# Altium schematic sheet starter.SchDoc
size A4
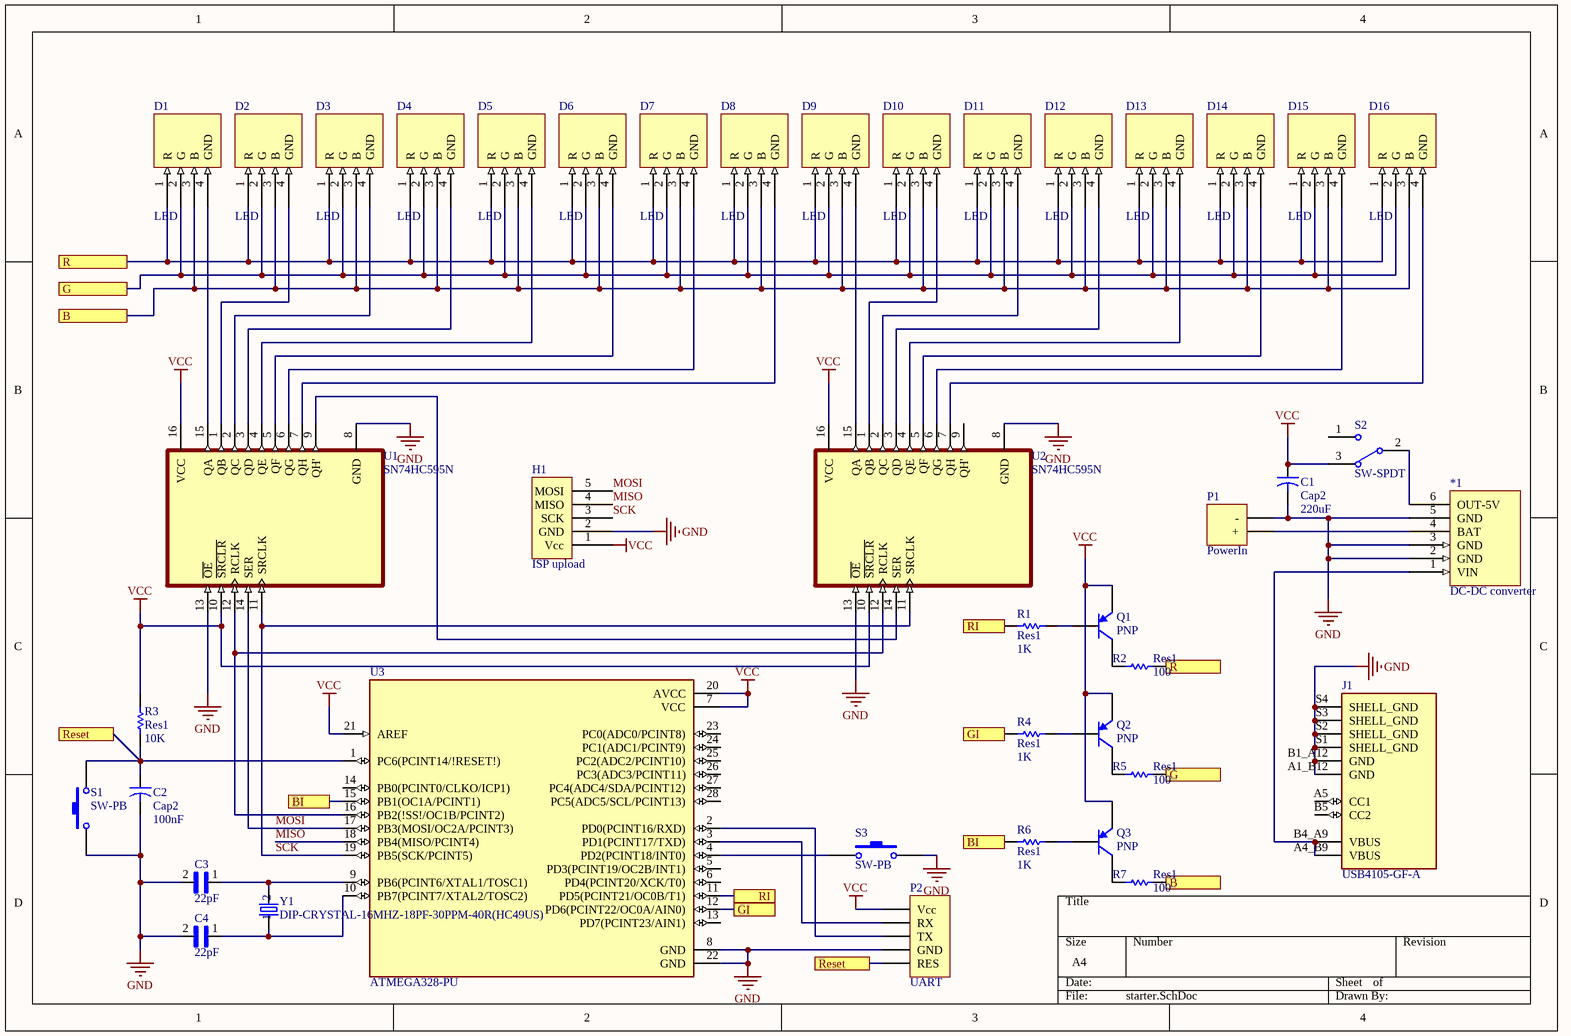
[diagram p0: starter.SchDoc]

## Parts
*1  DC-DC converter  [DC-DC converter]
C1  Cap2  value 220uF  [cap 220]
C2  Cap2  value 100nF  [CAPR5-4X5]
C3  22pF  [CAPR5-4X5]
C4  22pF  [CAPR5-4X5]
D1  LED  [RGB LED]
D2  LED  [RGB LED]
D3  LED  [RGB LED]
D4  LED  [RGB LED]
D5  LED  [RGB LED]
D6  LED  [RGB LED]
D7  LED  [RGB LED]
D8  LED  [RGB LED]
D9  LED  [RGB LED]
D10  LED  [RGB LED]
D11  LED  [RGB LED]
D12  LED  [RGB LED]
D13  LED  [RGB LED]
D14  LED  [RGB LED]
D15  LED  [RGB LED]
D16  LED  [RGB LED]
H1  ISP upload  [HDR1X5]
J1  USB4105-GF-A  [GCT_USB4105-GF-A]
P1  PowerIn  [PowerIn]
P2  UART  [UART]
Q1  PNP  [TO-226-AE]
Q2  PNP  [TO-226-AE]
Q3  PNP  [TO-226-AE]
R1  Res1  value 1K  [AXIAL-0.3]
R2  Res1  value 100  [AXIAL-0.3]
R3  Res1  value 10K  [AXIAL-0.3]
R4  Res1  value 1K  [AXIAL-0.3]
R5  Res1  value 100  [AXIAL-0.3]
R6  Res1  value 1K  [AXIAL-0.3]
R7  Res1  value 100  [AXIAL-0.3]
S1  SW-PB  [SPST-2]
S2  SW-SPDT  [SW-TRI]
S3  SW-PB  [SPST-2]
U1  SN74HC595N  [DIP794W45P254L1969H508Q16]
U2  SN74HC595N  [DIP794W45P254L1969H508Q16]
U3  ATMEGA328-PU  [DIP787W46P254L3467H508Q28]
Y1  DIP-CRYSTAL-16MHZ-18PF-30PPM-40R(HC49US)  [HC49US]

## Ports
B, BI, G, GI, R, Reset, RI

## Nets
GND: *1.2(GND) *1.3(GND) *1.5(GND) C1.2 C2.2 C3.2 C4.2 H1.2(GND) J1.A1_B12(GND) J1.B1_A12(GND) J1.S1(SHELL_GND) J1.S2(SHELL_GND) J1.S3(SHELL_GND) J1.S4(SHELL_GND) P1.2(-) P2.4(GND) S1.1 S3.2 U1.8(GND) U1.13(~{OE}) U2.8(GND) U2.13(~{OE}) U3.8(GND) U3.22(GND)
VCC: C1.1 H1.1(Vcc) P2.1(Vcc) Q1.3(E) Q2.3(E) Q3.3(E) R3.2 S2.3 U1.10(~{SRCLR}) U1.16(VCC) U2.10(~{SRCLR}) U2.16(VCC) U3.7(VCC) U3.20(AVCC) U3.21(AREF)
B: D1.3(B) D2.3(B) D3.3(B) D4.3(B) D5.3(B) D6.3(B) D7.3(B) D8.3(B) D9.3(B) D10.3(B) D11.3(B) D12.3(B) D13.3(B) D14.3(B) D15.3(B) D16.3(B) R7.2 ; port B
BI: R6.2 U3.15(PB1(OC1A/PCINT1)) ; port BI
G: D1.2(G) D2.2(G) D3.2(G) D4.2(G) D5.2(G) D6.2(G) D7.2(G) D8.2(G) D9.2(G) D10.2(G) D11.2(G) D12.2(G) D13.2(G) D14.2(G) D15.2(G) D16.2(G) R5.2 ; port G
GI: R4.2 U3.12(PD6(PCINT22/OC0A/AIN0)) ; port GI
MISO: H1.4(MISO) U3.18(PB4(MISO/PCINT4))
MOSI: H1.5(MOSI) U1.14(SER) U3.17(PB3(MOSI/OC2A/PCINT3))
R: D1.1(R) D2.1(R) D3.1(R) D4.1(R) D5.1(R) D6.1(R) D7.1(R) D8.1(R) D9.1(R) D10.1(R) D11.1(R) D12.1(R) D13.1(R) D14.1(R) D15.1(R) D16.1(R) R2.2 ; port R
Reset: C2.1 P2.5(RES) R3.1 S1.2 U3.1(PC6(PCINT14/!RESET!)) ; port Reset
RI: R1.2 U3.11(PD5(PCINT21/OC0B/T1)) ; port RI
SCK: H1.3(SCK) U1.11(SRCLK) U2.11(SRCLK) U3.19(PB5(SCK/PCINT5))
Net*1_1: *1.1(VIN) J1.A4_B9(VBUS) J1.B4_A9(VBUS)
Net*1_4: *1.4(BAT) P1.1(+)
Net*1_6: *1.6(OUT-5V) S2.2
NetC3_1: C3.1 U3.9(PB6(PCINT6/XTAL1/TOSC1)) Y1.2
NetC4_1: C4.1 U3.10(PB7(PCINT7/XTAL2/TOSC2)) Y1.1
NetD1_4: D1.4(GND) U1.15(QA)
NetD2_4: D2.4(GND) U1.1(QB)
NetD3_4: D3.4(GND) U1.2(QC)
NetD4_4: D4.4(GND) U1.3(QD)
NetD5_4: D5.4(GND) U1.4(QE)
NetD6_4: D6.4(GND) U1.5(QF)
NetD7_4: D7.4(GND) U1.6(QG)
NetD8_4: D8.4(GND) U1.7(QH)
NetD9_4: D9.4(GND) U2.15(QA)
NetD10_4: D10.4(GND) U2.1(QB)
NetD11_4: D11.4(GND) U2.2(QC)
NetD12_4: D12.4(GND) U2.3(QD)
NetD13_4: D13.4(GND) U2.4(QE)
NetD14_4: D14.4(GND) U2.5(QF)
NetD15_4: D15.4(GND) U2.6(QG)
NetD16_4: D16.4(GND) U2.7(QH)
NetP2_2: P2.2(RX) U3.3(PD1(PCINT17/TXD))
NetP2_3: P2.3(TX) U3.2(PD0(PCINT16/RXD))
NetQ1_1: Q1.1(C) R2.1
NetQ1_2: Q1.2(B) R1.1
NetQ2_1: Q2.1(C) R5.1
NetQ2_2: Q2.2(B) R4.1
NetQ3_1: Q3.1(C) R7.1
NetQ3_2: Q3.2(B) R6.1
NetS3_1: S3.1 U3.4(PD2(PCINT18/INT0))
NetU1_9: U1.9(QH') U2.14(SER)
NetU1_12: U1.12(RCLK) U2.12(RCLK) U3.16(PB2(!SS!/OC1B/PCINT2))

Not connected (* = marked no-connect by the designer): J1 A5(CC1) B5(CC2); S2 1; U2 9(QH'); U3 5(PD3(PCINT19/OC2B/INT1)) 6(PD4(PCINT20/XCK/T0)) 13(PD7(PCINT23/AIN1)) 14(PB0(PCINT0/CLKO/ICP1)) 23(PC0(ADC0/PCINT8)) 24(PC1(ADC1/PCINT9)) 25(PC2(ADC2/PCINT10)) 26(PC3(ADC3/PCINT11)) 27(PC4(ADC4/SDA/PCINT12)) 28(PC5(ADC5/SCL/PCINT13))

## Library data of the parts
C1 = Cap220: Capacitor; Published: 23-Sep-2002; PackageReference: CAPR5-4X5; Publisher: Altium Limited; PackageDescription: Capacitor; 2 Leads
C2 = Cap2: Capacitor; Published: 23-Sep-2002; PackageReference: CAPR5-4X5; Publisher: Altium Limited; PackageDescription: Capacitor; 2 Leads
C3 C4 = 22pF: SMD Capacitor X6S(EIA) with Capacitance: 22pF; MF: Murata; MP: GRM319C81C106MA12J; Value: *; Price: None; Package: 1206 Murata; SnapEDA_Link: https://www.snapeda.com/parts/GRM319C81C106MA12J/Murata/view-part/1894707/?ref=snap; Availability: Warning; Purchase-URL: https://pricing.snapeda.com/search/part/GRM319C81C106MA12J/?ref=eda; Check_prices: https://www.snapeda.com/parts/GRM319C81C106MA12J/Murata/view-part/1894707/?ref=eda
D1-D16 = RGB LED: pin to pad: 2>4 4>2
J1 = USB4105-GF-A: USB-C (USB TYPE-C) USB 2.0 Receptacle Connector 24 (16+8 Dummy) Position Surface Mount, Right Angle; Through Hole; pin to pad: A1_B12>B12 A4_B9>B9 B1_A12>A12 B4_A9>A9; MF: GCT; Price: None; Value: *; MP: USB4105-GF-A; Package: None; Purchase-URL: https://pricing.snapeda.com/search/part/USB4105-GF-A/?ref=eda; SnapEDA_Link: https://www.snapeda.com/parts/USB4105-GF-A/Global%20Connector%20Technology/view-part/4423780/?ref=snap; Check_prices: https://www.snapeda.com/parts/USB4105-GF-A/Global%20Connector%20Technology/view-part/4423780/?ref=eda; Availability: Warning
P1 = PowerIn: Header, 2-Pin; LatestRevisionDate: 17-Jul-2002; LatestRevisionNote: Re-released for DXP Platform.; Publisher: Altium Limited
P2 = UART: Header, 5-Pin, UART, for uploading; LatestRevisionDate: 17-Jul-2002; LatestRevisionNote: Re-released for DXP Platform.; Publisher: Altium Limited
Q1-Q3 = C9013: PNP Bipolar Transistor; pin to pad: 1>3 3>1; Published: 8-Jun-2000; LatestRevisionDate: 29-May-2009; LatestRevisionNote: IPC-7351 Footprint Added.; PackageVersion: Aug-1999; PackageReference: SOT-23B; Publisher: Altium Limited; PackageDescription: 3-Pin SOT-23 Package 0.95 mm Pitch, 2.4 mm Lead Span
R1-R7 = Res1: Resistor; Published: 8-Jun-2000; LatestRevisionDate: 17-Jul-2002; LatestRevisionNote: Re-released for DXP Platform.; PackageReference: AXIAL-0.3; Publisher: Altium Limited; PackageDescription: Axial Device, Thru-Hole; 2 Leads; 0.3 in Pin Spacing
S1 S3 = SW-PB: Switch; Published: 24-Mar-1999; LatestRevisionDate: 17-Jul-2002; LatestRevisionNote: Re-released for DXP Platform.; PackageReference: SPST-2; Publisher: Altium Limited; PackageDescription: Switch; 2 Leads
S2 = SW-SPDT: SPDT Subminiature Toggle Switch, Right Angle Mounting, Vertical Actuation; Published: 24-Mar-1999; LatestRevisionDate: 17-Dec-2003; LatestRevisionNote: Schematic revised, PCB Footprint replaced.; DatasheetVersion: 05-Dec-2000; PackageReference: TL36WW15050; Publisher: Altium Limited; PackageDescription: Switch; 4 Leads; ComponentLink1Description: Manufacturer Link; ComponentLink1URL: http://www.apem.com
U1 U2 = SN74HC595N: 8-bit shift registers with 3-state output registers 16-PDIP -40 to 85; MF: Texas Instruments; MP: SN74HC595N; Price: None; Package: PDIP-16 Texas Instruments; Texas_Instruments-Purchase-URL: https://snapeda.com/shop?store=Texas+Instruments&id=2479486; Value: *; Availability: Unavailable; SnapEDA_Link: https://www.snapeda.com/parts/SN74HC595N/Texas%20Instruments/view-part/2479486/?ref=snap
U3 = ATMEGA328-PU: AVR AVRÂ® ATmega Microcontroller IC 8-Bit 20MHz 32KB (16K x 16) FLASH 28-PDIP; MF: Microchip Technology; Value: *; Check_prices: https://www.snapeda.com/parts/ATMEGA328-PU/Microchip/view-part/4833845/?ref=eda; Availability: Good; Package: DIP-28 Microchip Technology; SnapEDA_Link: https://www.snapeda.com/parts/ATMEGA328-PU/Microchip/view-part/4833845/?ref=snap; Purchase-URL: https://pricing.snapeda.com/search/part/ATMEGA328-PU/?ref=eda; Price: None; MP: ATMEGA328-PU
Y1 = DIP-CRYSTAL-16MHZ-18PF-30PPM-40R(HC49US): 306010014; MP: HC49US16000MHZ; MF: Kyocera; Package: None; Price: None; Availability: Unavailable; Value: *; SnapEDA_Link: https://www.snapeda.com/parts/HC49US16000MHZ/Kyocera/view-part/105665/?ref=snap